# Altium project ToucanEye.PrjPcb (part 3 of 4)
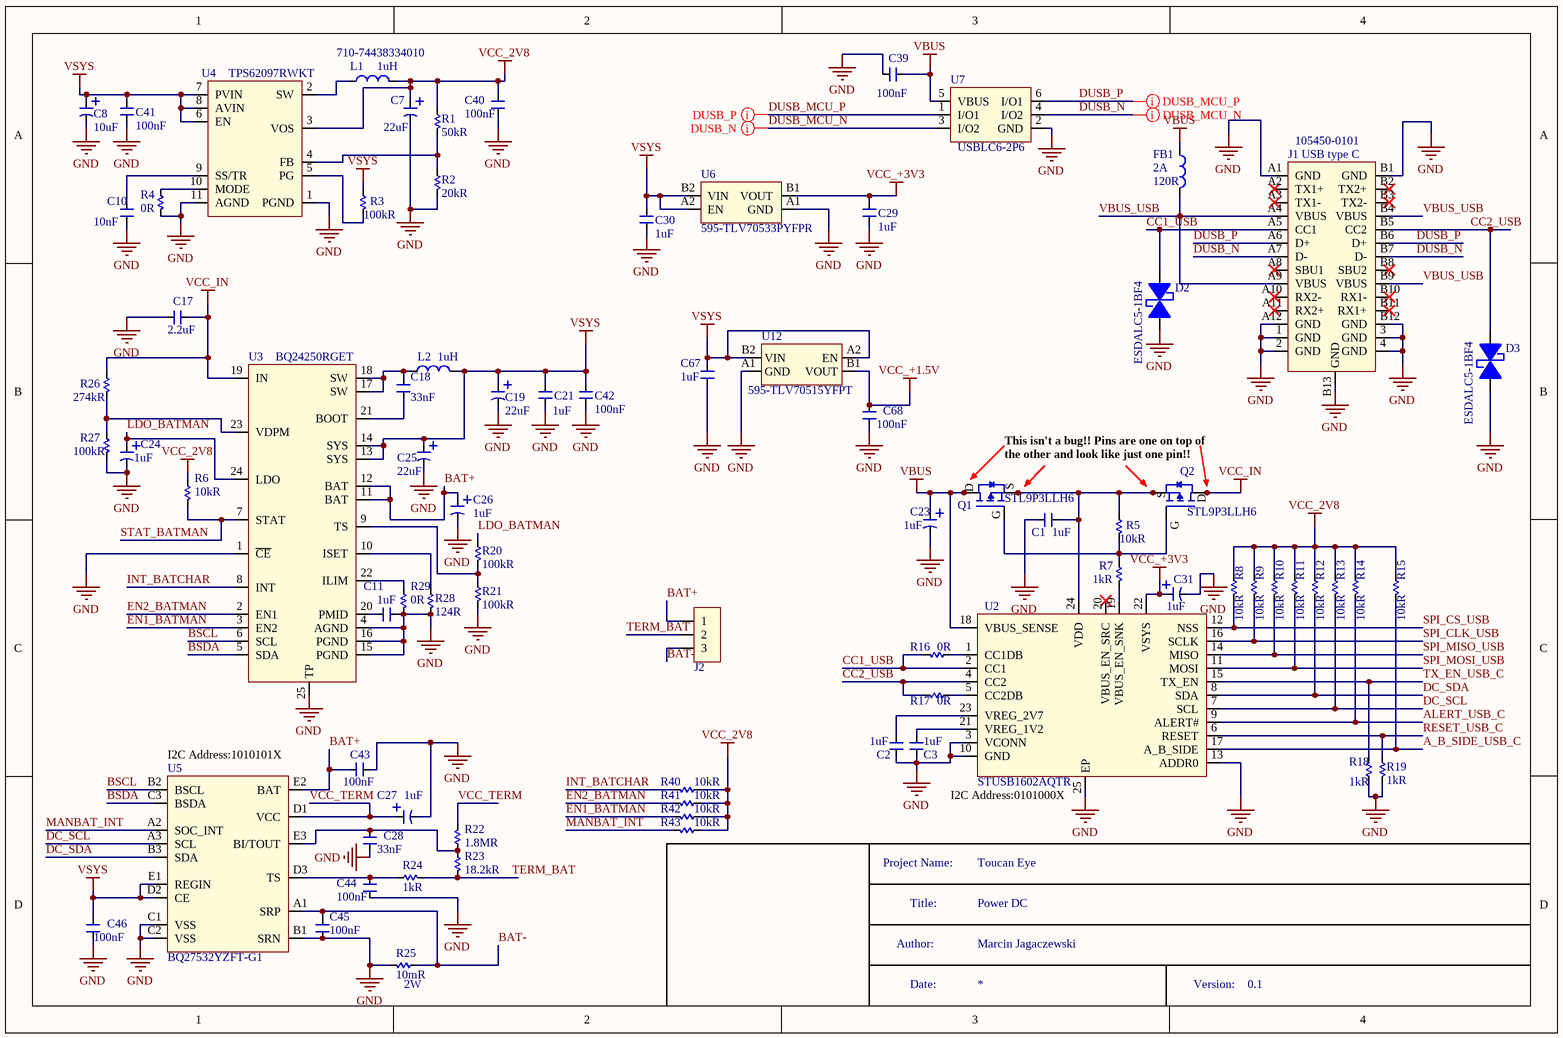
[diagram p8: DC.SchDoc]

## Sheet DC.SchDoc: param:Title (continued)

### Library data of the parts (continued)
U7 = USBLC6-2P6: TVS DIODE 5.25VWM 17VC SOT666; Manufacturer: STMicroelectronics; Direction: Unidirectional,Bidirectional; Clamping Voltage: 17V; Capacitance: 3.5pF; Number of Bidirectional Channels: 2; Reverse Standoff Voltage: 5V; Min Breakdown Voltage: 6V; Power Line Protection: Yes; Leakage Current: 150nA; Peak Pulse Current: 5A; Test Current: 1mA; Number of Elements: 1; Element Configuration: Dual; Supplier 1: Mouser; Stock 1: 6872; Pricing 1: 1=0.49, 10=0.405, 50=0.405, 100=0.247, 1000=0.191, 10000=0.152 (USD); Mount: Surface Mount; Case/Package: SOT-666; Number of Pins: 6; Contact Plating: Tin,Matte; Min Operating Temperature: -40°C; Max Operating Temperature: 125°C; Packaging: Tape and Reel; Package Quantity: 1; Breakdown Voltage: 6V; Operating Supply Voltage: 5V; Number of Channels: 2; Polarity: Unidirectional,Bidirectional; Termination: SMD/SMT; Working Voltage: 5V; ESD Protection: Yes; Max Reverse Leakage Current: 150nA; Reverse Breakdown Voltage: 6V; Max Breakdown Voltage: 6V; Length: 1.7mm; Height: 0.6mm; Depth: 1.3mm; Width: 1.3mm; Radiation Hardening: No; Lead Free: Lead Free; REACH SVHC: No SVHC; ComponentLink1URL: https://datasheet.ciiva.com/15143/getdatasheetpartid-98673-15143462.pdf; ComponentLink1Description: https://datasheet.ciiva.com/15143/getdatasheetpartid-98673-15143462.pdf; ComponentLink2URL: https://datasheet.ciiva.com/14186/usblc6-2-st-eng-tds-14186568.pdf; ComponentLink2Description: https://datasheet.ciiva.com/14186/usblc6-2-st-eng-tds-14186568.pdf; ComponentLink3URL: https://datasheet.ciiva.com/16378/cd00050750-16378714.pdf; ComponentLink3Description: https://datasheet.ciiva.com/16378/cd00050750-16378714.pdf; ComponentLink4URL: https://datasheet.ciiva.com/4508/cd00050750-4508892.pdf; ComponentLink4Description: https://datasheet.ciiva.com/4508/cd00050750-4508892.pdf; ComponentLink5URL: https://datasheet.ciiva.com/22685/1690354-22685832.pdf; ComponentLink5Description: https://datasheet.ciiva.com/22685/1690354-22685832.pdf; ComponentLink6URL: https://datasheet.ciiva.com/22692/1690354-22692453.pdf; ComponentLink6Description: https://datasheet.ciiva.com/22692/1690354-22692453.pdf; ComponentLink7URL: https://datasheet.ciiva.com/41444/001184108-da-01-en-ic-esd-protection-usblc6-2p6-sot-666-stm-41444134.pdf; ComponentLink7Description: https://datasheet.ciiva.com/41444/001184108-da-01-en-ic-esd-protection-usblc6-2p6-sot-666-stm-41444134.pdf; Supplier Part Number 1: 511-USBLC6-2P6; *SCHChecked: 1; *PCBChecked: 1; Manufacturer Part Number: USBLC6-2P6
U12 = TLV70515YFPT: LDO Voltage Regulators 200mA Lo IQ Lo-Noise LDO Reg; Manufacturer: Texas Instruments; Max Power Dissipation: 714mW; Max Input Voltage: 6V; Output Voltage: 1.5V; Dropout Voltage: 250mV; Min Input Voltage: 2V; Number of Regulators: 1; Min Current Limit: 260mA; Power Supply Rejection Ratio (PSRR): 80dB; Quiescent Current: 30uA; Supplier 1: Mouser; Manufacturer Part Number: TLV70515YFPT; Stock 1: 250; Pricing 1: 1=0.62, 10=0.513, 50=0.513, 100=0.313, 1000=0.242, 10000=0.192 (USD); Mount: Surface Mount; Number of Pins: 4; Min Operating Temperature: -40°C; Max Operating Temperature: 125°C; Packaging: Tape and Reel; Package Quantity: 250; Output Current: 200mA; Number of Outputs: 1; Lead Free: Lead Free; ComponentLink1URL: http://www.ti.com/lit/gpn/tlv705; ComponentLink1Description: http://www.ti.com/lit/gpn/tlv705; ComponentLink2URL: http://www.ti.com/lit/ds/symlink/tlv705.pdf; ComponentLink2Description: http://www.ti.com/lit/ds/symlink/tlv705.pdf; *SCHChecked: 1; *PCBChecked: 1

## Sheet TestPoints.SchDoc: param:Title
size A4; Author: param.Autor; Version: param:Version
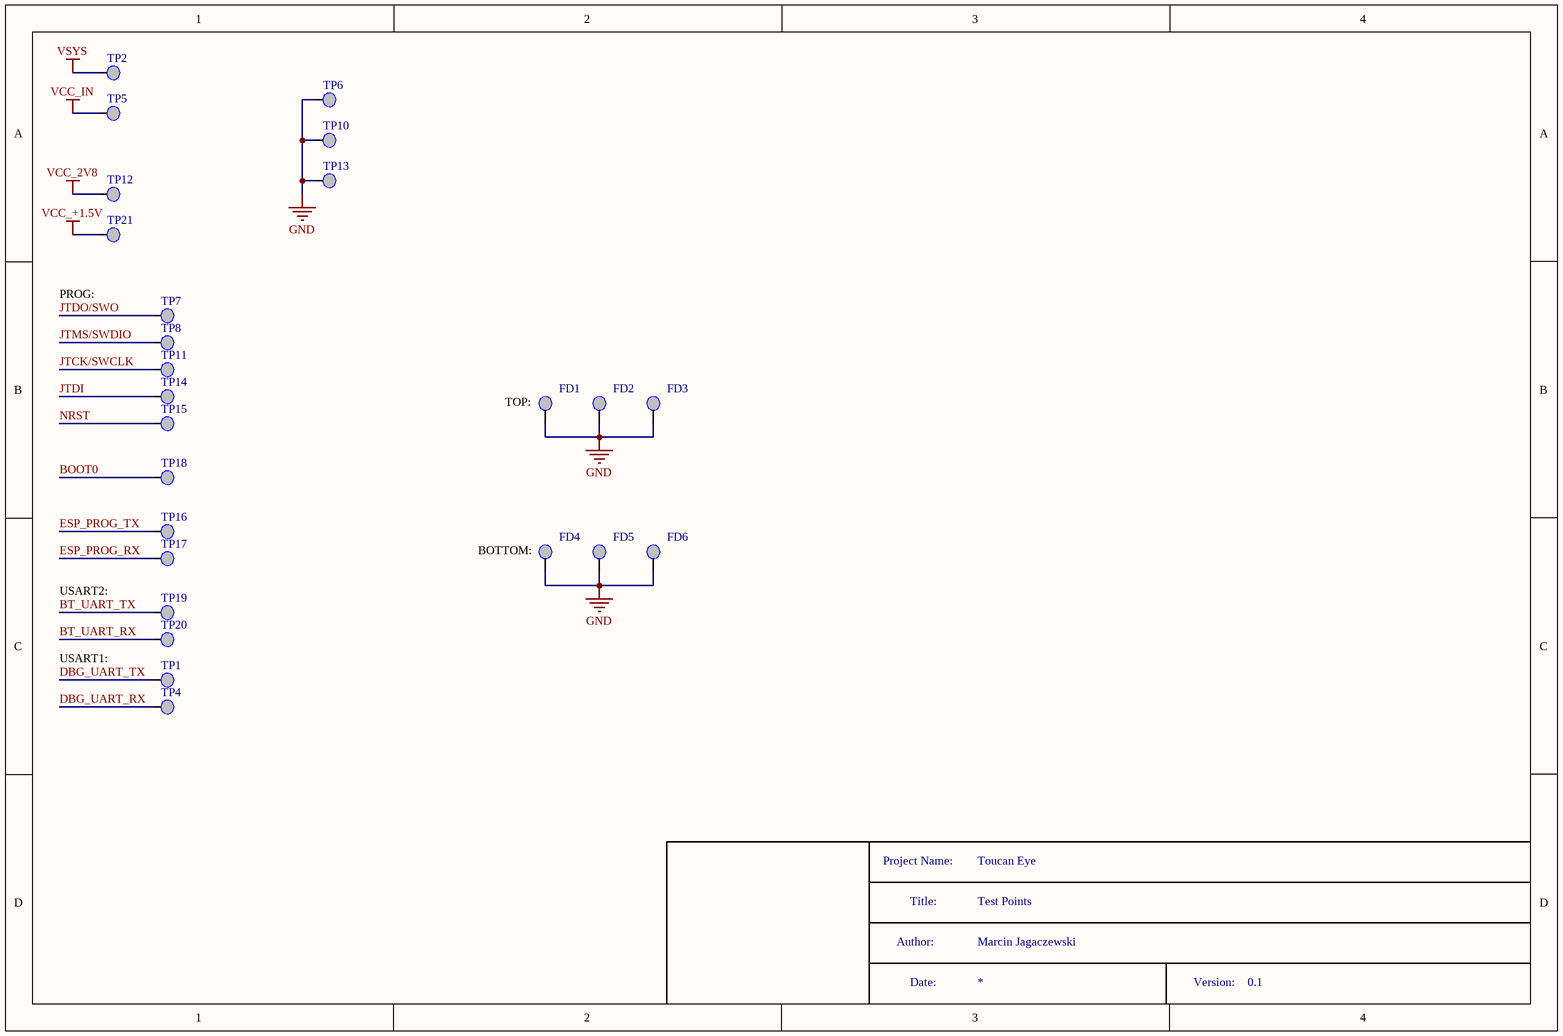
[diagram p2: TestPoints.SchDoc]

### Parts
FD1  Fiducial  [Fiducial]  (value not drawn)
FD2  Fiducial  [Fiducial]  (value not drawn)
FD3  Fiducial  [Fiducial]  (value not drawn)
FD4  Fiducial  [Fiducial]  (value not drawn)
FD5  Fiducial  [Fiducial]  (value not drawn)
FD6  Fiducial  [Fiducial]  (value not drawn)
TP1  Test_Point  [TP]  (value not drawn)  (no BOM)
TP2  Test_Point  [TP]  (value not drawn)  (no BOM)
TP4  Test_Point  [TP]  (value not drawn)  (no BOM)
TP5  Test_Point  [TP]  (value not drawn)  (no BOM)
TP6  Test_Point  [TP]  (value not drawn)  (no BOM)
TP7  Test_Point  [TP]  (value not drawn)  (no BOM)
TP8  Test_Point  [TP]  (value not drawn)  (no BOM)
TP10  Test_Point  [TP]  (value not drawn)  (no BOM)
TP11  Test_Point  [TP]  (value not drawn)  (no BOM)
TP12  Test_Point  [TP]  (value not drawn)  (no BOM)
TP13  Test_Point  [TP]  (value not drawn)  (no BOM)
TP14  Test_Point  [TP]  (value not drawn)  (no BOM)
TP15  Test_Point  [TP]  (value not drawn)  (no BOM)
TP16  Test_Point  [TP]  (value not drawn)  (no BOM)
TP17  Test_Point  [TP]  (value not drawn)  (no BOM)
TP18  Test_Point  [TP]  (value not drawn)  (no BOM)
TP19  Test_Point  [TP]  (value not drawn)  (no BOM)
TP20  Test_Point  [TP]  (value not drawn)  (no BOM)
TP21  Test_Point  [TP]  (value not drawn)  (no BOM)

### Nets
GND: FD1.1(GND) FD2.1(GND) FD3.1(GND) FD4.1(GND) FD5.1(GND) FD6.1(GND) TP6.1(TP) TP10.1(TP) TP13.1(TP)
VCC_2V8: TP12.1(TP)
VCC_+1.5V: TP21.1(TP)
VCC_IN: TP5.1(TP)
VSYS: TP2.1(TP)
BOOT0: TP18.1(TP)
BT_UART_RX: TP20.1(TP)
BT_UART_TX: TP19.1(TP)
DBG_UART_RX: TP4.1(TP)
DBG_UART_TX: TP1.1(TP)
ESP_PROG_RX: TP17.1(TP)
ESP_PROG_TX: TP16.1(TP)
JTCK/SWCLK: TP11.1(TP)
JTDI: TP14.1(TP)
JTDO/SWO: TP7.1(TP)
JTMS/SWDIO: TP8.1(TP)
NRST: TP15.1(TP)

### Notes on the sheet
- PROG:
- (near FD1) TOP:
- (near FD4) BOTTOM:
- USART2:
- USART1:
- Project Name:
- Title:
- Test Points
- Toucan Eye
- Author:
- Date:
- Marcin Jagaczewski
- Version:
- 0.1

### Library data of the parts
FD1-FD6 = Fiducial: SCHChecked: 1; PCBChecked: 1
TP1 TP2 TP4-TP8 TP10-TP21 = Test_Point: *SCHChecked: 1; *PCBChecked: 1

## Sheet WROOM32.SchDoc: param:Title
size A4; Author: param.Autor; Version: param:Version
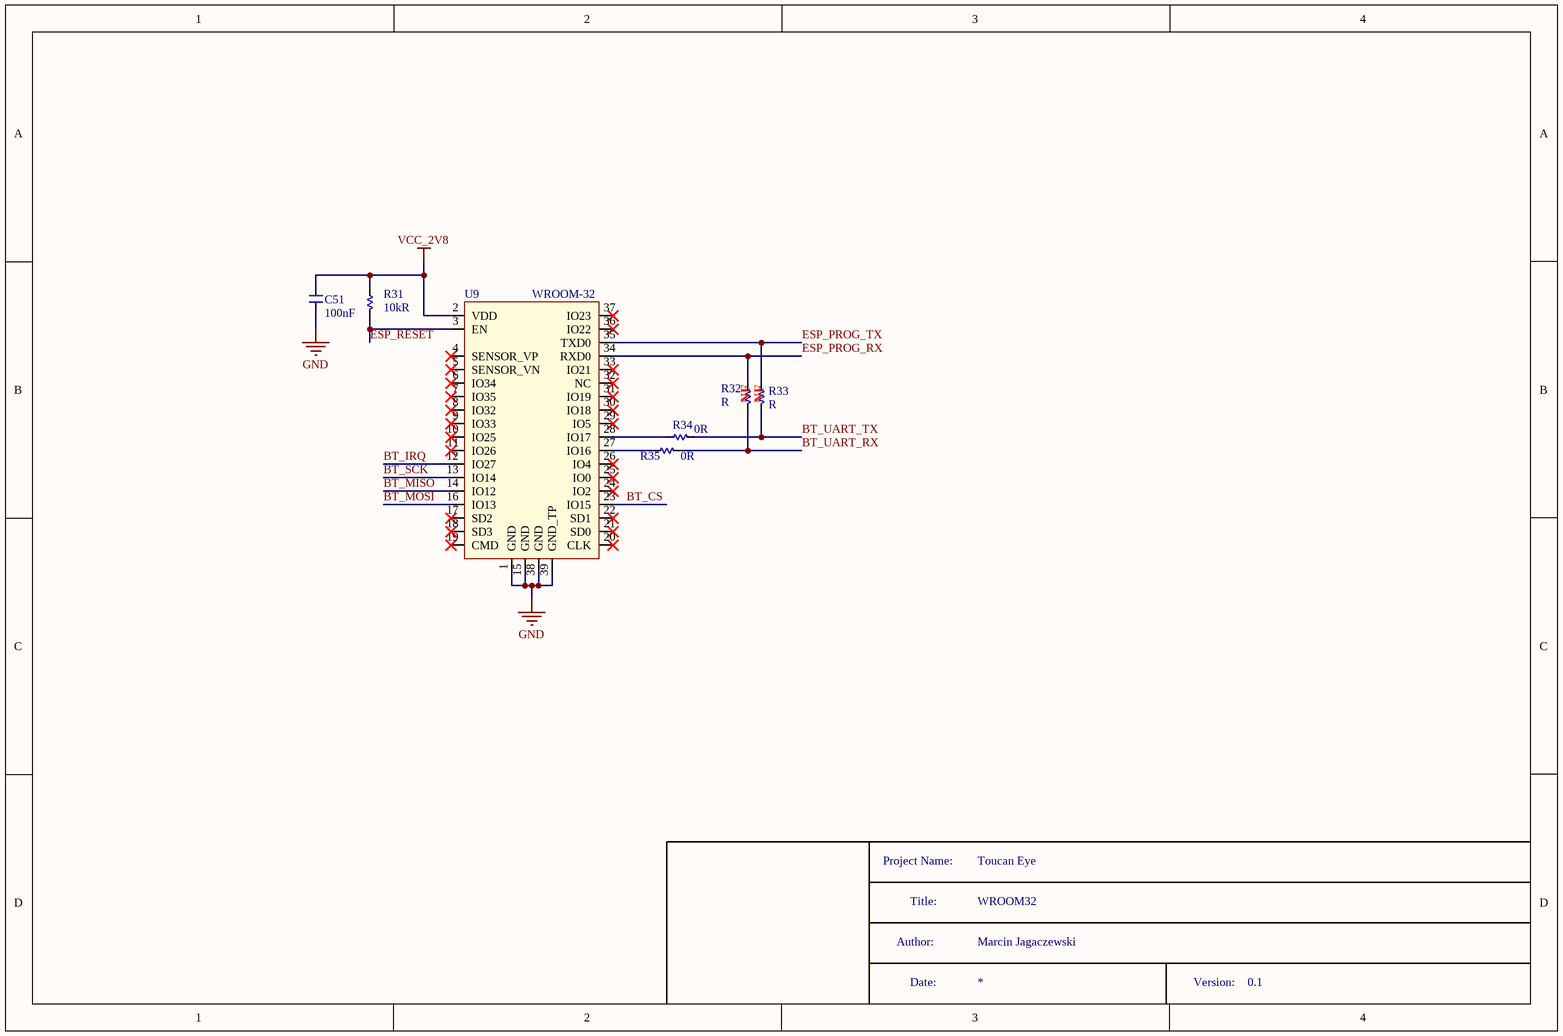
[diagram p3: WROOM32.SchDoc]

### Parts
C51  Capacitance: 100nF  [C_0201]  (hidden comment: C0201_100n_GRM033R6YA104KE14D)
R31  Resistance: 10kR  [R_0201]  (hidden comment: R0201_10k_ERJ-1GNF1002C)
R32  value R  [R_0201_NF]  (hidden comment: (NDI)0201)  (no BOM)
R33  value R  [R_0201_NF]  (hidden comment: (NDI)0201)  (no BOM)
R34  Resistance: 0R  [R_0201]  (hidden comment: R0201_0_ERJ-1GN0R00C)
R35  Resistance: 0R  [R_0201]  (hidden comment: R0201_0_ERJ-1GN0R00C)
U9  WROOM-32  [WROOM-32]

### Nets
GND: C51.1 U9.1(GND) U9.15(GND) U9.38(GND) U9.39(GND_TP)
VCC_2V8: C51.2 R31.2 U9.2(VDD)
BT_CS: U9.23(IO15)
BT_IRQ: U9.12(IO27)
BT_MISO: U9.14(IO12)
BT_MOSI: U9.16(IO13)
BT_SCK: U9.13(IO14)
BT_UART_RX: R32.1 R35.1
BT_UART_TX: R33.1 R34.1
ESP_PROG_RX: R32.2 U9.34(RXD0)
ESP_PROG_TX: R33.2 U9.35(TXD0)
ESP_RESET: R31.1 U9.3(EN)
NetR34_2: R34.2 U9.28(IO17)
NetR35_2: R35.2 U9.27(IO16)

Not connected (* = marked no-connect by the designer): U9 4(SENSOR_VP)* 5(SENSOR_VN)* 6(IO34)* 7(IO35)* 8(IO32)* 9(IO33)* 10(IO25)* 11(IO26)* 17(SD2)* 18(SD3)* 19(CMD)* 20(CLK)* 21(SD0)* 22(SD1)* 24(IO2)* 25(IO0)* 26(IO4)* 29(IO5)* 30(IO18)* 31(IO19)* 32(NC)* 33(IO21)* 36(IO22)* 37(IO23)*

### Notes on the sheet
- Project Name:
- Title:
- WROOM32
- Toucan Eye
- Author:
- Date:
- Marcin Jagaczewski
- Version:
- 0.1
- (in symbol (NDI)0201) NF

### Library data of the parts
C51 = C0201_100n_GRM033R6YA104KE14D: Multilayer Ceramic Capacitors MLCC - SMD/SMT 0201 0.10uF 35volts *Derate Voltage/Temp; Manufacturer: Murata; Tolerance: 10%; Dielectric: X5R; Voltage Rating (DC): 35V; Supplier 1: Mouser; Manufacturer Part Number: GRM033R6YA104KE14D; Stock 1: 295799; Pricing 1: 1=0.1, 10=0.061, 50=0.061, 100=0.027, 1000=0.015, 10000=0.01 (USD); Mount: Surface Mount; Case/Package: 0201; Weight: 1.2E-05oz; Case Code (Metric): 0603; Case Code (Imperial): 0201; Min Operating Temperature: -55°C; Max Operating Temperature: 85°C; Packaging: Tape and Reel; Voltage Rating: 35V; Termination: SMD/SMT; Package Quantity: 15000; Length: 0.024inch; Height: 0.3mm; Width: 0.3mm; Thickness: 0.013inch; ComponentLink1URL: http://www.mouser.com/ds/2/281/c02e-2905.pdf; ComponentLink1Description: http://www.mouser.com/ds/2/281/c02e-2905.pdf; ComponentLink2URL: http://search.murata.co.jp/Ceramy/image/img/A01X/partnumbering_e_01.pdf; ComponentLink2Description: http://search.murata.co.jp/Ceramy/image/img/A01X/partnumbering_e_01.pdf; *SCHChecked: *; *PCBChecked: *; Supplier Part Number 1: 81-GRM33R6YA104KE14D
R31 = R0201_10k_ERJ-1GNF1002C: RESISTOR, 0201, 0.05W, 1%, 10K; Manufacturer: Panasonic ECG; Temperature Coefficient: 200ppm/°C; Power Rating: 50mW; Voltage Rating: 25V; *SCHChecked: 1; Supplier 1: Mouser; Manufacturer Part Number: ERJ-1GNF1002C; Stock 1: 896102; Pricing 1: 1=0.49, 10=0.045, 50=0.045, 100=0.018, 1000=0.013, 10000=0.007 (USD); Mount: Surface Mount; Case/Package: 0201; Number of Pins: 2; Contact Plating: Tin,Matte; Case Code (Metric): 0603; Case Code (Imperial): 0201; Min Operating Temperature: -55°C; Max Operating Temperature: 125°C; Tolerance: 1%; Composition: Thick Film; Packaging: Tape and Reel; Package Quantity: 15000; Number of Terminations: 2; Military Standard: Not; Max Power Dissipation: 50mW; Voltage Rating (DC): 25V; Length: 0.6mm; Height: 0.01inch; Width: 0.012inch; Depth: 0.3mm; Radiation Hardening: No; REACH SVHC: Unknown; Lead Free: Lead Free; ComponentLink1URL: https://datasheet.ciiva.com/16508/aoa0000ce2-16508478.pdf; ComponentLink1Description: https://datasheet.ciiva.com/16508/aoa0000ce2-16508478.pdf; ComponentLink2URL: https://datasheet.ciiva.com/28514/1678782-28514095.pdf; ComponentLink2Description: https://datasheet.ciiva.com/28514/1678782-28514095.pdf; ComponentLink3URL: https://datasheet.ciiva.com/28514/1678782-28514085.pdf; ComponentLink3Description: https://datasheet.ciiva.com/28514/1678782-28514085.pdf; ComponentLink4URL: https://datasheet.ciiva.com/43467/1678782-43467078.pdf; ComponentLink4Description: https://datasheet.ciiva.com/43467/1678782-43467078.pdf; *PCBChecked: 1; Supplier Part Number 1: 667-ERJ-1GNF1002C
R34 R35 = R0201_0_ERJ-1GN0R00C: RES SMD 0.0OHM JUMPER 1/20W 0201; Manufacturer: Panasonic; Power Rating: 50mW; Tolerance: 1%; Voltage Rating: 25V; Temperature Coefficient: 600ppm/°C; *PCBChecked: 1; Supplier 1: Mouser; Manufacturer Part Number: ERJ-1GN0R00C; Stock 1: 835293; Pricing 1: 1=0.21, 10=0.02, 50=0.02, 100=0.008, 1000=0.005, 10000=0.003 (USD); Mount: Surface Mount; Case/Package: 0201; Case Code (Imperial): 0201; Case Code (Metric): 0603; Contact Plating: Tin; Min Operating Temperature: -55°C; Max Operating Temperature: 125°C; Packaging: Tape and Reel; Package Quantity: 15000; Composition: Thick Film; Military Standard: Not; Voltage Rating (DC): 25V; Length: 0.6mm; Height: 0.23mm; Width: 0.3mm; Depth: 0.3mm; REACH SVHC: Unknown; Lead Free: Lead Free; ComponentLink1URL: https://datasheet.ciiva.com/22730/1678796-22730749.pdf; ComponentLink1Description: https://datasheet.ciiva.com/22730/1678796-22730749.pdf; *SCHChecked: 1; Supplier Part Number 1: 667-ERJ-1GN0R00C
U9 = WROOM-32: *SCHChecked: 1; *PCBChecked: 1; Name: WROOM-32
R32 R33 = (NDI)0201: *SCHChecked: *; *PCBChecked: *

## Sheet PSRAM.SchDoc: param:Title
size A4; Author: param.Autor; Version: param:Version
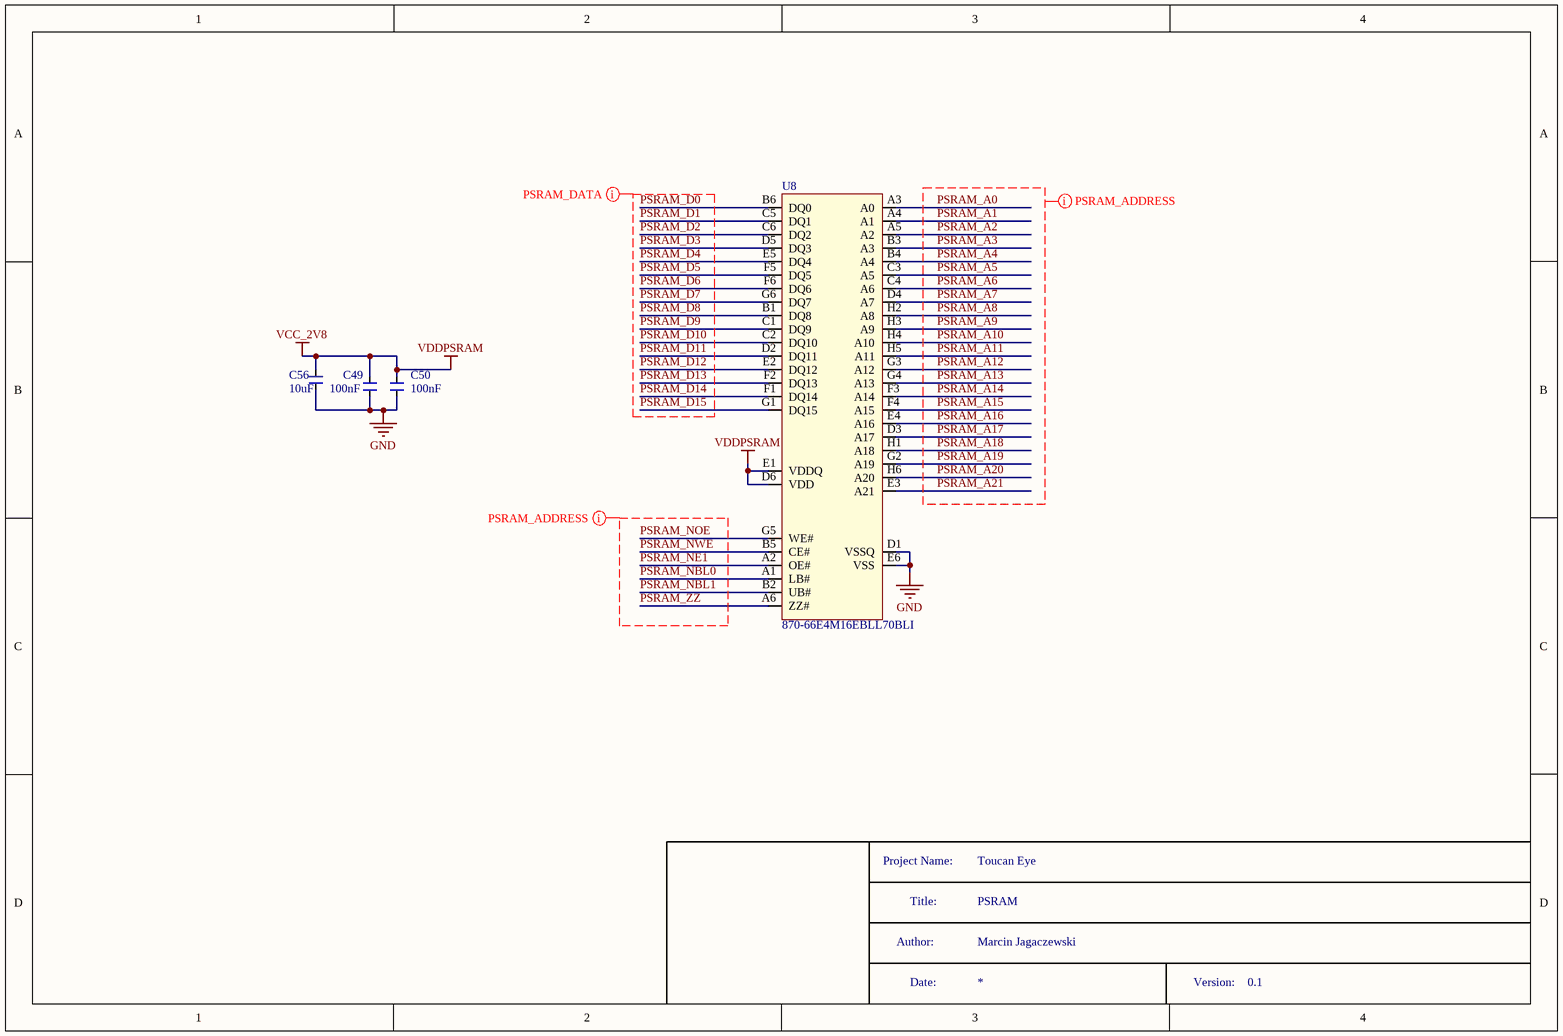
[diagram p4: PSRAM.SchDoc]

### Parts
C49  Capacitance: 100nF  [C_0201]  (hidden comment: C0201_100n_GRM033R6YA104KE14D)
C50  Capacitance: 100nF  [C_0201]  (hidden comment: C0201_100n_GRM033R6YA104KE14D)
C56  Capacitance: 10uF  [C_0402]  (hidden comment: C0402_10u_GRM155C80J106ME11D)
U8  Supplier Part Number 1: 870-66E4M16EBLL70BLI  [BGA48C75P6X8_600X800X120]  (hidden comment: IS66WVE4M16EBLL-70BLI)

### Nets
GND: C49.1 C50.1 C56.1 U8.D1(VSSQ) U8.E6(VSS)
VCC_2V8: C49.2 C50.2 C56.2 U8.D6(VDD) U8.E1(VDDQ)  [also labelled VDDPSRAM]
PSRAM_A0: U8.A3(A0)
PSRAM_A1: U8.A4(A1)
PSRAM_A2: U8.A5(A2)
PSRAM_A3: U8.B3(A3)
PSRAM_A4: U8.B4(A4)
PSRAM_A5: U8.C3(A5)
PSRAM_A6: U8.C4(A6)
PSRAM_A7: U8.D4(A7)
PSRAM_A8: U8.H2(A8)
PSRAM_A9: U8.H3(A9)
PSRAM_A10: U8.H4(A10)
PSRAM_A11: U8.H5(A11)
PSRAM_A12: U8.G3(A12)
PSRAM_A13: U8.G4(A13)
PSRAM_A14: U8.F3(A14)
PSRAM_A15: U8.F4(A15)
PSRAM_A16: U8.E4(A16)
PSRAM_A17: U8.D3(A17)
PSRAM_A18: U8.H1(A18)
PSRAM_A19: U8.G2(A19)
PSRAM_A20: U8.H6(A20)
PSRAM_A21: U8.E3(A21)
PSRAM_D0: U8.B6(DQ0)
PSRAM_D1: U8.C5(DQ1)
PSRAM_D2: U8.C6(DQ2)
PSRAM_D3: U8.D5(DQ3)
PSRAM_D4: U8.E5(DQ4)
PSRAM_D5: U8.F5(DQ5)
PSRAM_D6: U8.F6(DQ6)
PSRAM_D7: U8.G6(DQ7)
PSRAM_D8: U8.B1(DQ8)
PSRAM_D9: U8.C1(DQ9)
PSRAM_D10: U8.C2(DQ10)
PSRAM_D11: U8.D2(DQ11)
PSRAM_D12: U8.E2(DQ12)
PSRAM_D13: U8.F2(DQ13)
PSRAM_D14: U8.F1(DQ14)
PSRAM_D15: U8.G1(DQ15)
PSRAM_NBL0: U8.A1(LB#)
PSRAM_NBL1: U8.B2(UB#)
PSRAM_NE1: U8.A2(OE#)
PSRAM_NOE: U8.G5(WE#)
PSRAM_NWE: U8.B5(CE#)
PSRAM_ZZ: U8.A6(ZZ#)

### Layout directives
net class PSRAM_DATA: PSRAM_D0, PSRAM_D1, PSRAM_D2, PSRAM_D3, PSRAM_D4, PSRAM_D5, PSRAM_D6, PSRAM_D7, PSRAM_D8, PSRAM_D9, PSRAM_D10, PSRAM_D11, PSRAM_D12, PSRAM_D13, PSRAM_D14, PSRAM_D15
net class PSRAM_ADDRESS: PSRAM_A0, PSRAM_A1, PSRAM_A2, PSRAM_A3, PSRAM_A4, PSRAM_A5, PSRAM_A6, PSRAM_A7, PSRAM_A8, PSRAM_A9, PSRAM_A10, PSRAM_A11, PSRAM_A12, PSRAM_A13, PSRAM_A14, PSRAM_A15, PSRAM_A16, PSRAM_A17, PSRAM_A18, PSRAM_A19, PSRAM_A20, PSRAM_A21, PSRAM_NBL0, PSRAM_NBL1, PSRAM_NE1, PSRAM_NOE, PSRAM_NWE, PSRAM_ZZ

### Notes on the sheet
- Project Name:
- Title:
- PSRAM
- Toucan Eye
- Author:
- Date:
- Marcin Jagaczewski
- Version:
- 0.1

### Library data of the parts
C49 C50 = C0201_100n_GRM033R6YA104KE14D: as C51 on sheet WROOM32; Supplier 1: Mouser; Manufacturer Part Number: GRM033R6YA104KE14D; Stock 1: 295799; Pricing 1: 1=0.1, 10=0.061, 50=0.061, 100=0.027, 1000=0.015, 10000=0.01 (USD); Mount: Surface Mount; Case/Package: 0201; Weight: 1.2E-05oz; Case Code (Metric): 0603; Case Code (Imperial): 0201; Min Operating Temperature: -55°C; Max Operating Temperature: 85°C; Packaging: Tape and Reel; Voltage Rating: 35V; Termination: SMD/SMT; Package Quantity: 15000; Length: 0.024inch; Height: 0.3mm; Width: 0.3mm; Thickness: 0.013inch; ComponentLink1URL: http://www.mouser.com/ds/2/281/c02e-2905.pdf; ComponentLink1Description: http://www.mouser.com/ds/2/281/c02e-2905.pdf; ComponentLink2URL: http://search.murata.co.jp/Ceramy/image/img/A01X/partnumbering_e_01.pdf; ComponentLink2Description: http://search.murata.co.jp/Ceramy/image/img/A01X/partnumbering_e_01.pdf; *SCHChecked: *; *PCBChecked: *; Supplier Part Number 1: 81-GRM33R6YA104KE14D
C56 = C0402_10u_GRM155C80J106ME11D: 10µF 6.3V Ceramic Capacitor X6S 0402 (1005 Metric) 0.039" L x 0.020" W (1.00mm x 0.50mm); Manufacturer: Murata; Tolerance: 20%; *SCHChecked: 1; Supplier 1: Mouser; Manufacturer Part Number: GRM155C80J106ME11D; Stock 1: 134415; Pricing 1: 1=0.17, 10=0.125, 50=0.125, 100=0.059, 1000=0.034, 10000=0.024 (USD); Mount: Surface Mount; Case/Package: 0402; Case Code (Metric): 1005; Case Code (Imperial): 0402; Min Operating Temperature: -55°C; Max Operating Temperature: 105°C; Packaging: Tape and Reel; Voltage Rating: 6.3V; Voltage Rating (DC): 6.3V; Dielectric: X6S; Length: 0.039inch; Width: 0.02inch; Thickness: 0.028inch; ComponentLink1URL: http://search.murata.co.jp/Ceramy/image/img/A01X/partnumbering_e_01.pdf; ComponentLink1Description: http://search.murata.co.jp/Ceramy/image/img/A01X/partnumbering_e_01.pdf; Supplier Part Number 1: 81-GRM155C80J106ME1D; *PCBChecked: 1
U8 = IS66WVE4M16EBLL-70BLI: PSRAM Async 64M-Bit 4M x 16 70ns 48-Pin TFBGA; Manufacturer: ISSI; Density: 64Mb; Address Bus Width: 22b; Number of Ports: 1; Supplier 1: Mouser; Manufacturer Part Number: IS66WVE4M16EBLL-70BLI; Stock 1: 3544; Pricing 1: 1=4.47, 10=3.94, 50=3.94, 100=3.53, 1000=3.01, 10000=2.85 (USD); Case/Package: TFBGA; Min Operating Temperature: -40°C; Max Operating Temperature: 85°C; ComponentLink1URL: http://www.mouser.com/ds/2/198/66-67WVE4M16EALL-BLL-CLL-462616.pdf; ComponentLink1Description: http://www.mouser.com/ds/2/198/66-67WVE4M16EALL-BLL-CLL-462616.pdf; ComponentLink2URL: http://www.issi.com/WW/pdf/66-67WVE4M16EALL-BLL-CLL.pdf; ComponentLink2Description: http://www.issi.com/WW/pdf/66-67WVE4M16EALL-BLL-CLL.pdf; *SCHChecked: 1; *PCBChecked: 1

## Sheet AUDIO.SchDoc: param:Title
size A4; Author: param.Autor; Version: param:Version
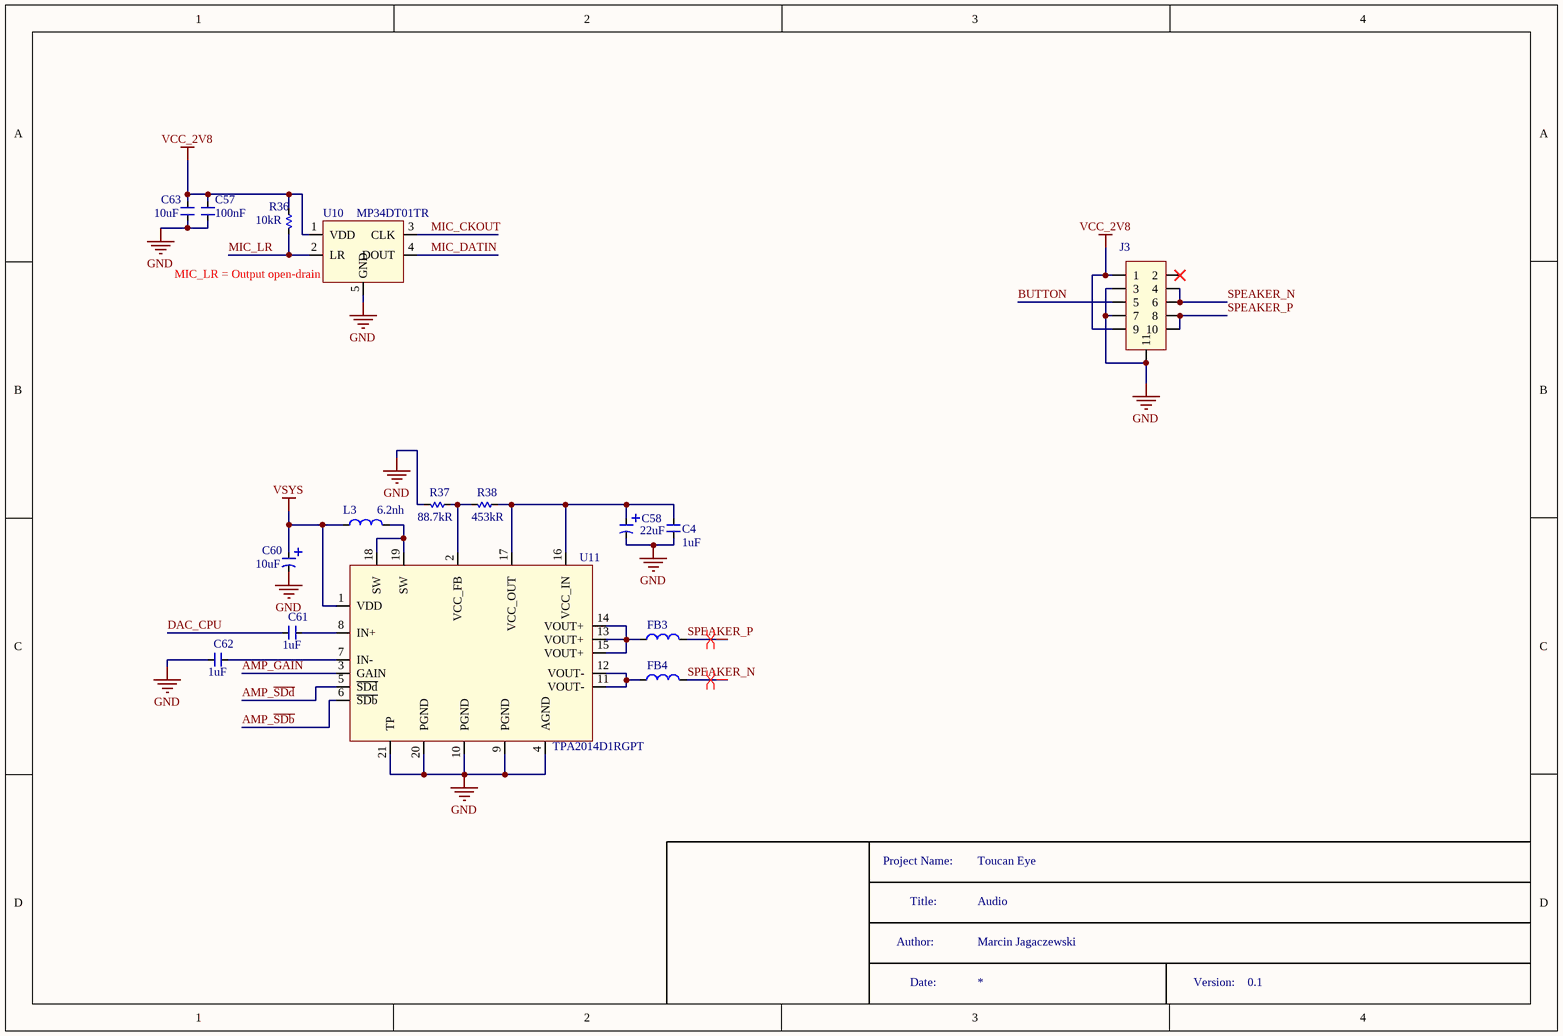
[diagram p5: AUDIO.SchDoc]

### Parts
C4  Capacitance: 1uF  [C_0402]  (hidden comment: C0402_1uF_TMK105BJ105MV-F)
C57  Capacitance: 100nF  [C_0201]  (hidden comment: C0201_100n_GRM033R6YA104KE14D)
C58  Capacitance: 22uF  [C_3216]  (hidden comment: C_22u_TANTAL_A_T491A226K006AT)
C60  Capacitance: 10uF  [C_3216]  (hidden comment: C_10u_TANTAL_A_T491A106K010AT7280)
C61  Capacitance: 1uF  [C_0402]  (hidden comment: C0402_1uF_TMK105BJ105MV-F)
C62  Capacitance: 1uF  [C_0402]  (hidden comment: C0402_1uF_TMK105BJ105MV-F)
C63  Capacitance: 10uF  [C_0402]  (hidden comment: C0402_10u_GRM155C80J106ME11D)
FB3  BLM18EG121SN1D  [L_0603]  (value not drawn)
FB4  BLM18EG121SN1D  [L_0603]  (value not drawn)
J3  BM10NB(0.6)-10DS-0.4V(51)  [BM10NB(0.6)-10DS-0.4V(51)]  (value not drawn)
L3  Inductance: 6.2nh  [L_0402]  (hidden comment: 744765062A)
R36  Resistance: 10kR  [R_0201]  (hidden comment: R0201_10k_ERJ-1GNF1002C)
R37  Resistance: 88.7kR  [R_0201]  (hidden comment: R0201_88.7k_ERJ-1GNF8872C)
R38  Resistance: 453kR  [R_0201]  (hidden comment: R0201_453k_RC0201FR-07453KL)
U10  MP34DT01TR  [HCLGA]
U11  TPA2014D1RGPT  [QFN_16x0,5]

### Nets
GND: C4.1 C57.1 C58.2 C60.2 C62.1 C63.1 J3.3 J3.7 J3.11 R37.1 U10.5(GND) U11.4(AGND) U11.9(PGND) U11.10(PGND) U11.20(PGND) U11.21(TP)
VCC_2V8: C57.2 C63.2 J3.1 J3.9 R36.2 U10.1(VDD)
VSYS: C60.1 L3.1(Vcc) U11.1(VDD)
AMP_GAIN: U11.3(GAIN)
AMP_~{SDb}: U11.6(~{SDb})
AMP_~{SDd}: U11.5(~{SDd})
BUTTON: J3.5
DAC_CPU: C61.1
MIC_CKOUT: U10.3(CLK)
MIC_DATIN: U10.4(DOUT)
MIC_LR: R36.1 U10.2(LR)
SPEAKER_N: FB4.2(Vcc) J3.4 J3.6
SPEAKER_P: FB3.2(Vcc) J3.8 J3.10
NetC4_2: C4.2 C58.1 R38.2 U11.16(VCC_IN) U11.17(VCC_OUT)
NetC61_2: C61.2 U11.8(IN+)
NetC62_2: C62.2 U11.7(IN-)
NetFB3_1: FB3.1(Vcc) U11.13(VOUT+) U11.14(VOUT+) U11.15(VOUT+)
NetFB4_1: FB4.1(Vcc) U11.11(VOUT-) U11.12(VOUT-)
NetL3_2: L3.2(Vcc) U11.18(SW) U11.19(SW)
NetR37_2: R37.2 R38.1 U11.2(VCC_FB)

Not connected (* = marked no-connect by the designer): J3 2*

### Layout directives
differential pair: SPEAKER_N, SPEAKER_P

### Notes on the sheet
- (near U10) MIC_LR = Output open-drain
- Project Name:
- Title:
- Audio
- Toucan Eye
- Author:
- Date:
- Marcin Jagaczewski
- Version:
- 0.1

### Library data of the parts
C4 C61 C62 = C0402_1uF_TMK105BJ105MV-F: CAP CER 1UF 25V X5R 0402; Manufacturer: Taiyo Yuden; Tolerance: 20%; *PCBChecked: 1; Supplier 1: Mouser; Manufacturer Part Number: TMK105BJ105MV-F; Stock 1: 60117; Pricing 1: 1=0.28, 10=0.098, 50=0.098, 100=0.054, 1000=0.028, 10000=0.019 (USD); Mount: Surface Mount; Case/Package: 0402; Case Code (Metric): 1005; Case Code (Imperial): 0402; Min Operating Temperature: -55°C; Max Operating Temperature: 85°C; Packaging: Tape and Reel; Package Quantity: 1; Voltage Rating (DC): 25V; Dielectric: X5R; Termination: SMD/SMT; Voltage Rating: 25V; Composition: Ceramic; Length: 1mm; Height: 0.5mm; Width: 0.02inch; Thickness: 0.022inch; Depth: 0.5mm; Radiation Hardening: No; Halogen Free: Halogen Free; ComponentLink1URL: https://datasheet.ciiva.com/30154/128tmk105bj105mv-f-30154639.pdf; ComponentLink1Description: https://datasheet.ciiva.com/30154/128tmk105bj105mv-f-30154639.pdf; ComponentLink2URL: https://datasheet.ciiva.com/15922/tmk105bj105mv-f-pdf-15922317.pdf; ComponentLink2Description: https://datasheet.ciiva.com/15922/tmk105bj105mv-f-pdf-15922317.pdf; ComponentLink3URL: https://datasheet.ciiva.com/11596/tmk105bj105mv-f-ss-11596466.pdf; ComponentLink3Description: https://datasheet.ciiva.com/11596/tmk105bj105mv-f-ss-11596466.pdf; ComponentLink4URL: https://datasheet.ciiva.com/13404/mlcc-all-e-541559-13404206.pdf; ComponentLink4Description: https://datasheet.ciiva.com/13404/mlcc-all-e-541559-13404206.pdf; *SCHChecked: 1; Supplier Part Number 1: 963-TMK105BJ105MV-F
C57 = C0201_100n_GRM033R6YA104KE14D: as C51 on sheet WROOM32; Supplier 1: Mouser; Manufacturer Part Number: GRM033R6YA104KE14D; Stock 1: 295799; Pricing 1: 1=0.1, 10=0.061, 50=0.061, 100=0.027, 1000=0.015, 10000=0.01 (USD); Mount: Surface Mount; Case/Package: 0201; Weight: 1.2E-05oz; Case Code (Metric): 0603; Case Code (Imperial): 0201; Min Operating Temperature: -55°C; Max Operating Temperature: 85°C; Packaging: Tape and Reel; Voltage Rating: 35V; Termination: SMD/SMT; Package Quantity: 15000; Length: 0.024inch; Height: 0.3mm; Width: 0.3mm; Thickness: 0.013inch; ComponentLink1URL: http://www.mouser.com/ds/2/281/c02e-2905.pdf; ComponentLink1Description: http://www.mouser.com/ds/2/281/c02e-2905.pdf; ComponentLink2URL: http://search.murata.co.jp/Ceramy/image/img/A01X/partnumbering_e_01.pdf; ComponentLink2Description: http://search.murata.co.jp/Ceramy/image/img/A01X/partnumbering_e_01.pdf; *SCHChecked: *; *PCBChecked: *; Supplier Part Number 1: 81-GRM33R6YA104KE14D
C58 = C_22u_TANTAL_A_T491A226K006AT: Cap Tant Solid 22uF 6.3V A CASE 10% (3.2 X 1.6 X 1.6mm) SMD 3216-18 4 Ohm 125C T/R; Manufacturer: KEMET; Dielectric Material: Tantalum; ESR (Equivalent Series Resistance): 4R; Ripple Current: 137mA; Leakage Current: 1.4uA; Polarity: Polar; Dissipation Factor: 6%; Life (Hours): 2000Hour; *PCBChecked: 1; Supplier 1: Mouser; Manufacturer Part Number: T491A226K006AT; Stock 1: 2818; Pricing 1: 1=0.42, 10=0.239, 50=0.239, 100=0.144, 1000=0.118, 10000=0.08 (USD); Mount: Surface Mount,PCB; Case/Package: 1206; Number of Pins: 2; Case Code (Metric): 3216; Case Code (Imperial): 1206; Min Operating Temperature: -55°C; Max Operating Temperature: 125°C; Tolerance: 10%; Packaging: Tape and Reel; Voltage Rating: 6.3V; Package Quantity: 1; Failure Rate: 0.001%; Termination: SMD/SMT; Voltage: 6.3V; Voltage Rating (DC): 6.3V; Length: 3.2mm; Height: 1.6mm; Depth: 1.6mm; Width: 0.063inch; Height - Seated (Max): 0.071inch; Lead Pitch: 1.2mm; Radiation Hardening: No; Lead Free: Lead Free; REACH SVHC: No SVHC; ComponentLink1URL: https://datasheet.ciiva.com/12884/kem-t2005-t491-12884456.pdf; ComponentLink1Description: https://datasheet.ciiva.com/12884/kem-t2005-t491-12884456.pdf; ComponentLink2URL: https://datasheet.ciiva.com/6248/kem-t2005-t491-6248094.pdf; ComponentLink2Description: https://datasheet.ciiva.com/6248/kem-t2005-t491-6248094.pdf; ComponentLink3URL: https://datasheet.ciiva.com/28488/1854511-28488485.pdf; ComponentLink3Description: https://datasheet.ciiva.com/28488/1854511-28488485.pdf; ComponentLink4URL: https://datasheet.ciiva.com/5934/kem-t2005-t491-5934246.pdf; ComponentLink4Description: https://datasheet.ciiva.com/5934/kem-t2005-t491-5934246.pdf; *SCHChecked: 1; Supplier Part Number 1: 80-T491A226K006
C60 = C_10u_TANTAL_A_T491A106K010AT7280: CAP TANT 10UF 10V 10% 1206; Manufacturer: KEMET; ESR (Equivalent Series Resistance): 3.8R; Polarity: Polar; Dissipation Factor: 6%; Life (Hours): 2000Hour; Supplier 1: Mouser; Manufacturer Part Number: T491A106K010AT7280; Stock 1: 0; Pricing 1: 1=0.39, 10=0.223, 50=0.223, 100=0.134, 1000=0.096, 10000=0.074 (USD); Mount: Surface Mount; Case/Package: 1206; Case Code (Metric): 3216; Case Code (Imperial): 1206; Min Operating Temperature: -55°C; Max Operating Temperature: 125°C; Tolerance: 10%; Packaging: Tape and Reel; Voltage Rating: 10V; Package Quantity: 1; Termination: SMD/SMT; Resistance: 3.8R; Failure Rate: 0.001%; Length: 3.2mm; Height: 1.8mm; Depth: 1.6mm; Width: 0.063inch; Height - Seated (Max): 0.071inch; Lead Free: Lead Free; ComponentLink1URL: https://datasheet.ciiva.com/12911/kem-t2005-t491-12911022.pdf; ComponentLink1Description: https://datasheet.ciiva.com/12911/kem-t2005-t491-12911022.pdf; ComponentLink2URL: https://datasheet.ciiva.com/6248/kem-t2005-t491-6248182.pdf; ComponentLink2Description: https://datasheet.ciiva.com/6248/kem-t2005-t491-6248182.pdf; *SCHChecked: *; *PCBChecked: *; Supplier Part Number 1: 80-T491A106K107280
C63 = C0402_10u_GRM155C80J106ME11D: as C56 on sheet PSRAM; Supplier 1: Mouser; Manufacturer Part Number: GRM155C80J106ME11D; Stock 1: 134415; Pricing 1: 1=0.17, 10=0.125, 50=0.125, 100=0.059, 1000=0.034, 10000=0.024 (USD); Mount: Surface Mount; Case/Package: 0402; Case Code (Metric): 1005; Case Code (Imperial): 0402; Min Operating Temperature: -55°C; Max Operating Temperature: 105°C; Packaging: Tape and Reel; Voltage Rating: 6.3V; Voltage Rating (DC): 6.3V; Dielectric: X6S; Length: 0.039inch; Width: 0.02inch; Thickness: 0.028inch; ComponentLink1URL: http://search.murata.co.jp/Ceramy/image/img/A01X/partnumbering_e_01.pdf; ComponentLink1Description: http://search.murata.co.jp/Ceramy/image/img/A01X/partnumbering_e_01.pdf; Supplier Part Number 1: 81-GRM155C80J106ME1D; *PCBChecked: 1
FB3 FB4 = BLM18EG121SN1D: MURATA         BLM18EG121SN1D            FERRITE BEAD, 0.04OHM, 2A, 0603; Material: Steel,Ferrite; DC Resistance (DCR): 40mR; Impedance: 120R; Tolerance: 25%; Test Frequency: 100MHz; Number of Lines: 1; Supplier 1: Mouser; Manufacturer: Murata; Manufacturer Part Number: BLM18EG121SN1D; Stock 1: 9180; Pricing 1: 1=0.23, 10=0.134, 50=0.134, 100=0.095, 1000=0.073, 10000=0.058 (USD); Case/Package: 0603; Number of Pins: 2; Weight: 7.1E-05oz; Core Material: Ferrite; Case Code (Metric): 1608; Case Code (Imperial): 0603; Min Operating Temperature: -55°C; Max Operating Temperature: 125°C; Packaging: Tape and Reel; Current Rating: 2A; Max DC Current: 2A; Package Quantity: 1; Max Current Rating: 2A; Termination: SMD/SMT; DC Current: 2A; Military Standard: Not; Frequency: 100MHz; Number of Circuits: 1; Length: 1.6mm; Height: 0.8mm; Width: 0.8mm; Depth: 0.8mm; Radiation Hardening: No; REACH SVHC: No SVHC; Lead Free: Lead Free; ComponentLink1URL: https://datasheet.ciiva.com/34302/1844926-34302803.pdf; ComponentLink1Description: https://datasheet.ciiva.com/34302/1844926-34302803.pdf; ComponentLink2URL: https://datasheet.ciiva.com/11795/0900766b811b5866-11795397.pdf; ComponentLink2Description: https://datasheet.ciiva.com/11795/0900766b811b5866-11795397.pdf; ComponentLink3URL: https://datasheet.ciiva.com/41449/001172264-da-01-en-drossel-0603-120r-1-6x0-8mm-4000st-41449582.pdf; ComponentLink3Description: https://datasheet.ciiva.com/41449/001172264-da-01-en-drossel-0603-120r-1-6x0-8mm-4000st-41449582.pdf; ComponentLink4URL: https://datasheet.ciiva.com/41449/001171698-da-01-en-chip-drossel0603-120r-2000ma-1-6x0-8mm-41449378.pdf; ComponentLink4Description: https://datasheet.ciiva.com/41449/001171698-da-01-en-chip-drossel0603-120r-2000ma-1-6x0-8mm-41449378.pdf; ComponentLink5URL: https://datasheet.ciiva.com/14122/blm-series-eng-tds-14122904.pdf; ComponentLink5Description: https://datasheet.ciiva.com/14122/blm-series-eng-tds-14122904.pdf; ComponentLink6URL: https://datasheet.ciiva.com/3081/l0110s0101blm18e-3081624.pdf; ComponentLink6Description: https://datasheet.ciiva.com/3081/l0110s0101blm18e-3081624.pdf; ComponentLink7URL: https://datasheet.ciiva.com/17279/l0110s0101blm18e-17279548.pdf; ComponentLink7Description: https://datasheet.ciiva.com/17279/l0110s0101blm18e-17279548.pdf; ComponentLink8URL: https://datasheet.ciiva.com/18092/getdatasheetpartid-120977-18092965.pdf; ComponentLink8Description: https://datasheet.ciiva.com/18092/getdatasheetpartid-120977-18092965.pdf; ComponentLink9URL: https://datasheet.ciiva.com/1467/5169-1467155.pdf; ComponentLink9Description: https://datasheet.ciiva.com/1467/5169-1467155.pdf; ComponentLink10URL: https://datasheet.ciiva.com/1467/5169-1467156.pdf; ComponentLink10Description: https://datasheet.ciiva.com/1467/5169-1467156.pdf; ComponentLink11URL: https://datasheet.ciiva.com/16387/l0110s0101blm18e-16387655.pdf; ComponentLink11Description: https://datasheet.ciiva.com/16387/l0110s0101blm18e-16387655.pdf; ComponentLink12URL: https://datasheet.ciiva.com/6211/l0110s0101blm18e-6211463.pdf; ComponentLink12Description: https://datasheet.ciiva.com/6211/l0110s0101blm18e-6211463.pdf; *SCHChecked: 1; *PCBChecked: 1; Supplier Part Number 1: 81-BLM18EG121SN1D
J3 = BM10NB(0.6)-10DS-0.4V(51): CONN RCPT 10POS 0.4MM SMD GOLD; Manufacturer: Hirose; Number of Positions: 10; Connector Type: Receptacle; Pitch: 0.016inch; Stack Height: 0.6mm; *SCHChecked: 1; Supplier 1: Mouser; Manufacturer Part Number: BM10NB(0.6)-10DS-0.4V(51); Stock 1: 3831; Pricing 1: 1=0.63, 10=0.501, 50=0.501, 100=0.414, 1000=0.326, 10000=0.263 (USD); Mount: Surface Mount; Contact Plating: Gold; Package Quantity: 1; Number of Rows: 2; Packaging: Tape and Reel; Termination: SMD/SMT; ComponentLink1URL: http://www.mouser.com/catalog/specsheets/BM10_Flyer.pdf; ComponentLink1Description: http://www.mouser.com/catalog/specsheets/BM10_Flyer.pdf; ComponentLink2URL: https://www.hirose.com/product/download/?distributor=digikey&type=2d&lang=en&num=BM10NB(0.6)-10DS-0.4V(51); ComponentLink2Description: https://www.hirose.com/product/download/?distributor=digikey&type=2d&lang=en&num=BM10NB(0.6)-10DS-0.4V(51); *PCBChecked: 1; Supplier Part Number 1: 798-BM10NB0610DS4V51
L3 = 744765062A: FIXED IND 6.2NH 760MA 83 MOHM; Manufacturer: Wurth Electronics; Material: Ceramic; Tolerance: 5%; Shielding: Unshielded; Frequency: 250MHz; Self Resonant Frequency: 5.8GHz; Q Factor: 23; Resistance: 83mR; *SCHChecked: 1; Supplier 1: Mouser; Manufacturer Part Number: 744765062A; Stock 1: 1056; Pricing 1: 1=0.41, 10=0.39, 50=0.363, 100=0.336, 1000=0.282, 10000=0.255 (USD); Mount: Surface Mount; Case/Package: 0402; Number of Pins: 2; Weight: 2.3E-05oz; Case Code (Metric): 1005; Case Code (Imperial): 0402; Core Material: Ceramic; Min Operating Temperature: -40°C; Max Operating Temperature: 125°C; Package Quantity: 3000; Current Rating: 760mA; Packaging: Tape and Reel; Inductance Tolerance: 5%; Composition: Wirewound,Ceramic; DC Resistance (DCR): 83mR; Test Frequency: 250MHz; Max DC Current: 760mA; Termination: SMD/SMT; Series Resistance: 83mR; Length: 1mm; Height: 0.5mm; Width: 0.55mm; Height - Seated (Max): 0.024inch; Depth: 0.55mm; REACH SVHC: Unknown; ComponentLink1URL: https://datasheet.ciiva.com/11803/0900766b80f88b46-11803524.pdf; ComponentLink1Description: https://datasheet.ciiva.com/11803/0900766b80f88b46-11803524.pdf; ComponentLink2URL: https://datasheet.ciiva.com/6027/426746-6027077.pdf; ComponentLink2Description: https://datasheet.ciiva.com/6027/426746-6027077.pdf; ComponentLink3URL: https://datasheet.ciiva.com/1049/744765062a-1049024.pdf; ComponentLink3Description: https://datasheet.ciiva.com/1049/744765062a-1049024.pdf; ComponentLink4URL: https://datasheet.ciiva.com/4978/744765062a-58674-4978771.pdf; ComponentLink4Description: https://datasheet.ciiva.com/4978/744765062a-58674-4978771.pdf; ComponentLink5URL: https://datasheet.ciiva.com/26308/744765062a-eng-tds-26308299.pdf; ComponentLink5Description: https://datasheet.ciiva.com/26308/744765062a-eng-tds-26308299.pdf; ComponentLink6URL: https://datasheet.ciiva.com/7695/426746-7695834.pdf; ComponentLink6Description: https://datasheet.ciiva.com/7695/426746-7695834.pdf; Supplier Part Number 1: 710-744765062A; *PCBChecked: 1
R36 = R0201_10k_ERJ-1GNF1002C: as R31 on sheet WROOM32; Supplier 1: Mouser; Manufacturer Part Number: ERJ-1GNF1002C; Stock 1: 896102; Pricing 1: 1=0.49, 10=0.045, 50=0.045, 100=0.018, 1000=0.013, 10000=0.007 (USD); Mount: Surface Mount; Case/Package: 0201; Number of Pins: 2; Contact Plating: Tin,Matte; Case Code (Metric): 0603; Case Code (Imperial): 0201; Min Operating Temperature: -55°C; Max Operating Temperature: 125°C; Tolerance: 1%; Composition: Thick Film; Packaging: Tape and Reel; Package Quantity: 15000; Number of Terminations: 2; Military Standard: Not; Max Power Dissipation: 50mW; Voltage Rating (DC): 25V; Length: 0.6mm; Height: 0.01inch; Width: 0.012inch; Depth: 0.3mm; Radiation Hardening: No; REACH SVHC: Unknown; Lead Free: Lead Free; ComponentLink1URL: https://datasheet.ciiva.com/16508/aoa0000ce2-16508478.pdf; ComponentLink1Description: https://datasheet.ciiva.com/16508/aoa0000ce2-16508478.pdf; ComponentLink2URL: https://datasheet.ciiva.com/28514/1678782-28514095.pdf; ComponentLink2Description: https://datasheet.ciiva.com/28514/1678782-28514095.pdf; ComponentLink3URL: https://datasheet.ciiva.com/28514/1678782-28514085.pdf; ComponentLink3Description: https://datasheet.ciiva.com/28514/1678782-28514085.pdf; ComponentLink4URL: https://datasheet.ciiva.com/43467/1678782-43467078.pdf; ComponentLink4Description: https://datasheet.ciiva.com/43467/1678782-43467078.pdf; *PCBChecked: 1; Supplier Part Number 1: 667-ERJ-1GNF1002C
R37 = R0201_88.7k_ERJ-1GNF8872C: Thick Film Resistors - SMD 0201 88.7Kohm 1% Halogen Free; Manufacturer: Panasonic ECG; Power Rating: 50mW; Voltage Rating: 25V; Temperature Coefficient: 200ppm/°C; *SCHChecked: 1; Supplier 1: Mouser; Manufacturer Part Number: ERJ-1GNF8872C; Stock 1: 34794; Pricing 1: 1=0.49, 10=0.045, 50=0.045, 100=0.018, 1000=0.013, 10000=0.007 (USD); Mount: Surface Mount; Case/Package: 0201; Case Code (Imperial): 0201; Case Code (Metric): 0603; Contact Plating: Tin,Matte; Min Operating Temperature: -55°C; Max Operating Temperature: 125°C; Tolerance: 1%; Packaging: Tape and Reel; Package Quantity: 15000; Composition: Thick Film; Number of Terminations: 2; Max Power Dissipation: 50mW; Length: 0.024inch; Height: 0.01inch; Width: 0.3mm; Radiation Hardening: No; ComponentLink1URL: https://datasheet.ciiva.com/24026/aoa0000ce2-24026679.pdf; ComponentLink1Description: https://datasheet.ciiva.com/24026/aoa0000ce2-24026679.pdf; Supplier Part Number 1: 667-ERJ-1GNF8872C; *PCBChecked: 1
R38 = R0201_453k_RC0201FR-07453KL: Res Thick Film 0201 453K Ohm 1% 0.05W(1/20W) ±200ppm/C Molded SMD Paper T/R; Manufacturer: Yageo; Power Rating: 50mW; Temperature Coefficient: 200ppm/°C; *SCHChecked: 1; Supplier 1: Mouser; Manufacturer Part Number: RC0201FR-07453KL; Stock 1: 21967; Pricing 1: 1=0.1, 10=0.029, 50=0.029, 100=0.01, 1000=0.007, 10000=0.004 (USD); Case/Package: 0201; Case Code (Metric): 0603; Case Code (Imperial): 0201; Min Operating Temperature: -55°C; Max Operating Temperature: 125°C; Tolerance: 1%; Packaging: Tape and Reel; Composition: Thick Film; Number of Terminations: 2; Military Standard: Not; Max Power Dissipation: 50mW; Length: 0.024inch; Height: 0.01inch; Width: 0.012inch; Depth: 0.3mm; Lead Free: Lead Free; ComponentLink1URL: http://components.arrow.com/part/dataview/0323_03291826; ComponentLink1Description: http://components.arrow.com/part/dataview/0323_03291826; ComponentLink2URL: http://www.yageo.com.tw/exep/pages/download/literatures/PYu-R_INT-thick_7.pdf; ComponentLink2Description: http://www.yageo.com.tw/exep/pages/download/literatures/PYu-R_INT-thick_7.pdf; ComponentLink3URL: http://www.yageo.com/documents/recent/PYu-RC0201_51_RoHS_L_(8).pdf; ComponentLink3Description: http://www.yageo.com/documents/recent/PYu-RC0201_51_RoHS_L_(8).pdf; Supplier Part Number 1: 603-RC0201FR-07453KL; *PCBChecked: 1
U10 = MP34DT01TR: MIC MEMS DIGITAL PDM OMNI -26DB; Manufacturer: STMicroelectronics; Shape: Rectangular; Max Supply Voltage: 3.6V; Operating Supply Voltage: 1.8V; Min Supply Voltage: 1.64V; Operating Supply Current: 600uA; Direction: Omnidirectional; Number of Channels: 2; Signal to Noise Ratio (SNR): 63dB; *SCHChecked: 1; Supplier 1: Mouser; Manufacturer Part Number: MP34DT01TR; Stock 1: 10769; Pricing 1: 1=1.48, 10=1.25, 50=1.25, 100=1, 1000=0.725, 10000=0.625 (USD); Contact Plating: Nickel,Gold; Min Operating Temperature: -40°C; Max Operating Temperature: 85°C; Packaging: Tape and Reel; Voltage Rating: 3.6V; Termination: SMD/SMT; Output Type: Digital; Package Quantity: 4000; Length: 4mm; Height: 1.1mm; Width: 3mm; Depth: 1mm; Lead Free: Lead Free; ComponentLink1URL: https://datasheet.ciiva.com/15098/getdatasheetpartid-495516-15098984.pdf; ComponentLink1Description: https://datasheet.ciiva.com/15098/getdatasheetpartid-495516-15098984.pdf; ComponentLink2URL: https://datasheet.ciiva.com/5300/dm00039779-100783-5300131.pdf; ComponentLink2Description: https://datasheet.ciiva.com/5300/dm00039779-100783-5300131.pdf; ComponentLink3URL: https://datasheet.ciiva.com/1/dm00039779-1998.pdf; ComponentLink3Description: https://datasheet.ciiva.com/1/dm00039779-1998.pdf; ComponentLink4URL: https://datasheet.ciiva.com/1/dm00039779-1997.pdf; ComponentLink4Description: https://datasheet.ciiva.com/1/dm00039779-1997.pdf; ComponentLink5URL: https://datasheet.ciiva.com/1/dm00039779-1996.pdf; ComponentLink5Description: https://datasheet.ciiva.com/1/dm00039779-1996.pdf; Supplier Part Number 1: 511-MP34DT01TR; *PCBChecked: 1
U11 = TPA2014D1RGPT: IC AMP AUDIO PWR 1.5W D 20QFN; Manufacturer: Texas Instruments; Max Dual Supply Voltage: 5.5V; Voltage Gain: 20dB; Common Mode Rejection Ratio: 75dB; Max Power Dissipation: 2.5W; Dual Supply Voltage: 5V; Supply Type: Dual; Power Supply Rejection Ratio (PSRR): -91dB; *SCHChecked: 1; Supplier 1: Mouser; Stock 1: 117; Pricing 1: 1=2.27, 10=1.93, 50=1.93, 100=1.54, 1000=1.12, 10000=1.01 (USD); Case/Package: VQFN EP; Number of Pins: 20; Weight: 0.00163oz; Min Operating Temperature: -40°C; Max Operating Temperature: 85°C; Packaging: Tape and Reel; Output Power: 1.5W; Package Quantity: 1; Gain: 20dB; Max Output Power: 1.5W; Power Dissipation: 2.5W; Radiation Hardening: No; Lead Free: Lead Free; ComponentLink1URL: https://datasheet.ciiva.com/26117/slas559a-26117109.pdf; ComponentLink1Description: https://datasheet.ciiva.com/26117/slas559a-26117109.pdf; ComponentLink2URL: https://datasheet.ciiva.com/15131/getdatasheetpartid-48210-15131592.pdf; ComponentLink2Description: https://datasheet.ciiva.com/15131/getdatasheetpartid-48210-15131592.pdf; ComponentLink3URL: https://datasheet.ciiva.com/2969/tpa2014d1-2969824.pdf; ComponentLink3Description: https://datasheet.ciiva.com/2969/tpa2014d1-2969824.pdf; ComponentLink4URL: https://datasheet.ciiva.com/1789/tpa2014d1-1789239.pdf; ComponentLink4Description: https://datasheet.ciiva.com/1789/tpa2014d1-1789239.pdf; ComponentLink5URL: https://datasheet.ciiva.com/1789/tpa2014d1-1789237.pdf; ComponentLink5Description: https://datasheet.ciiva.com/1789/tpa2014d1-1789237.pdf; ComponentLink6URL: https://datasheet.ciiva.com/2967/tpa2014d1-2967858.pdf; ComponentLink6Description: https://datasheet.ciiva.com/2967/tpa2014d1-2967858.pdf; ComponentLink7URL: https://datasheet.ciiva.com/1789/tpa2014d1-1789238.pdf; ComponentLink7Description: https://datasheet.ciiva.com/1789/tpa2014d1-1789238.pdf; ComponentLink8URL: https://datasheet.ciiva.com/48706/001071077-da-01-en-ic-amp-audio-pw-tpa2014d1rgpt-qfn-20-tid-48706871.pdf; ComponentLink8Description: https://datasheet.ciiva.com/48706/001071077-da-01-en-ic-amp-audio-pw-tpa2014d1rgpt-qfn-20-tid-48706871.pdf; Supplier Part Number 1: 595-TPA2014D1RGPT; *PCBChecked: 1; Manufacturer Part Number: TPA2014D1RGPT